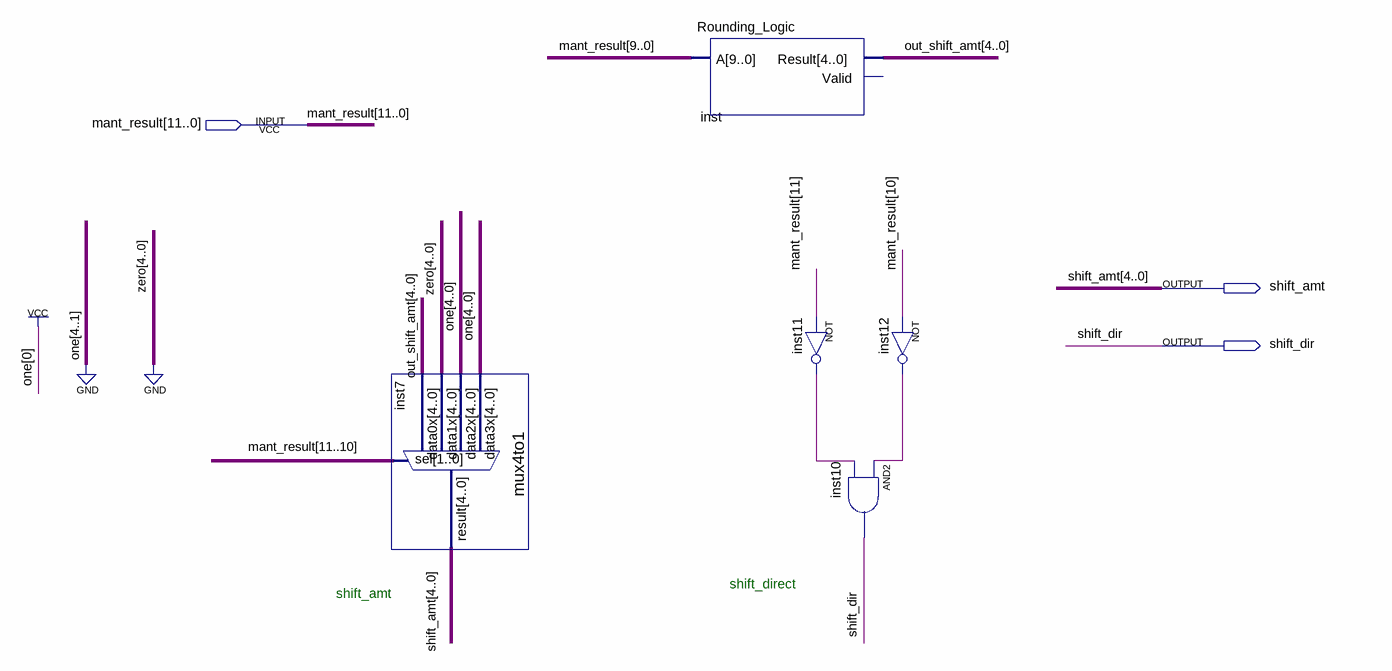
[diagram p0: schematic sheet]
// Quartus schematic normalize_control.bdf as structural Verilog: 5 symbols, 3 pins
module normalize_control (
  input  [11:0] mant_result,
  output shift_amt,
  output shift_dir
);

  wire inst11_out, inst12_out;
  wire [4:0] out_shift_amt, shift_amt_bus;

  mux4to1 inst7 (
    .data3x(5'b00001), .data2x(5'b00001), .data1x({5{1'b0}}), .data0x(out_shift_amt),
    .sel(mant_result[11:10]), .result(shift_amt_bus));
  Rounding_Logic inst (.A(mant_result[9:0]), .Result(out_shift_amt));  // open: Valid
  not inst11 (inst11_out, mant_result[11]);
  and inst10 (shift_dir, inst12_out, inst11_out);
  not inst12 (inst12_out, mant_result[10]);

  // Notes on the sheet:
  //   shift_direct
  //   shift_amt
endmodule
